# EAGLE design fabrickit-SnapBrick-Male-v22 (EAGLE 5.04)
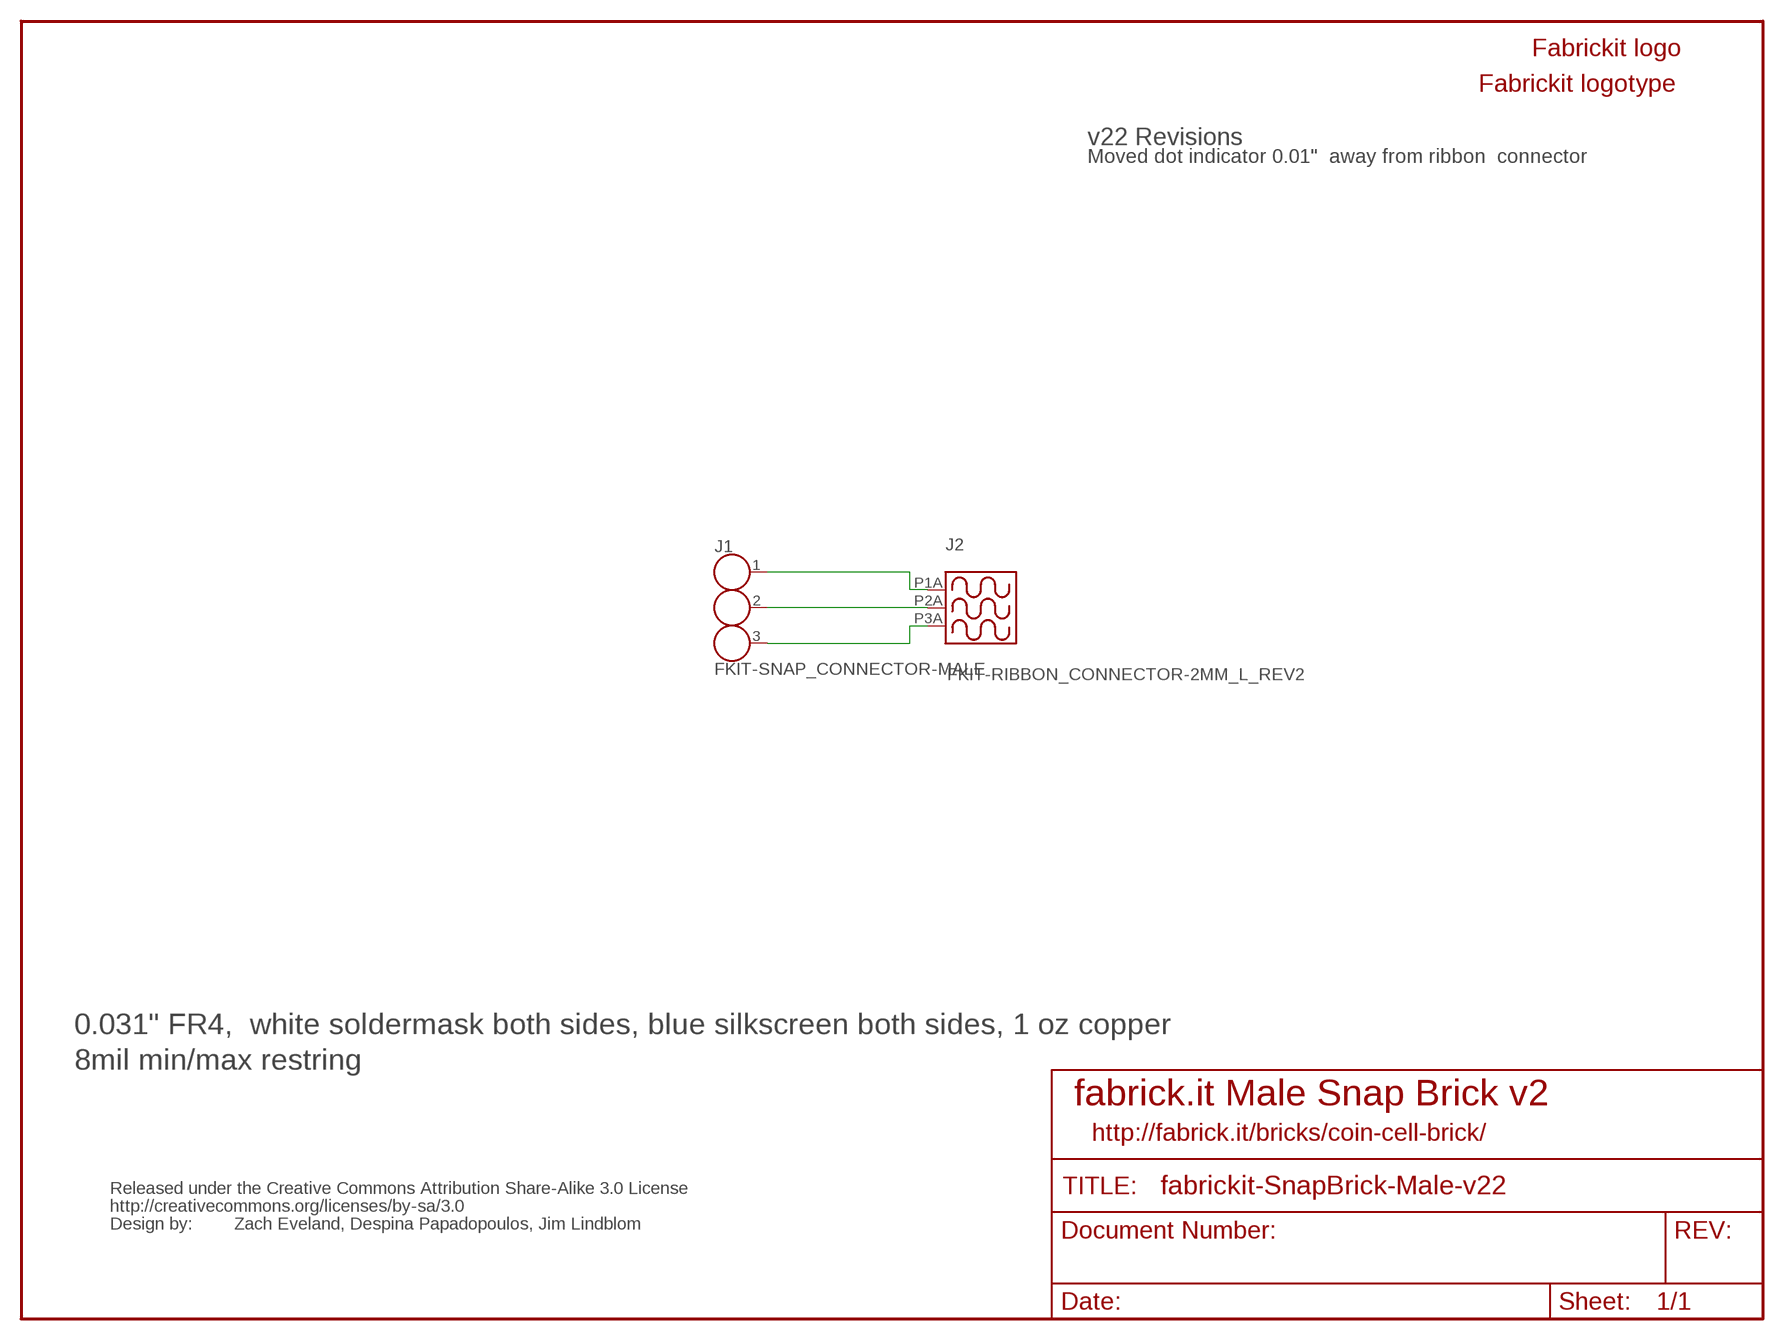
[diagram p0: schematic, sheet 1]

## Parts
J1  FKIT-SNAP_CONNECTOR-MALE  [FKIT-SNAP_MALE]
J2  FKIT-RIBBON_CONNECTOR-2MM_L_REV2  [FKIT-RIBBON_CONNECTOR_03_2MM_L]
LOGO1  FKIT-LOGO-SMALL  [FKIT-LOGO_SMALL]
LOGO2  FKIT-LOGOTYPE-MEDIUM  [FKIT-LOGOTYPE_MEDIUM]
U$1  CREATIVE_COMMONS  [CREATIVE_COMMONS]

## Nets
N$1: J1.3 J2.P3A
N$2: J1.2 J2.P2A
N$3: J1.1 J2.P1A

## Notes on the sheet
- v22 Revisions
- Moved dot indicator 0.01"  away from ribbon  connector
- 0.031" FR4,  white soldermask both sides, blue silkscreen both sides, 1 oz copper
- 8mil min/max restring
- fabrick.it Male Snap Brick v2
- http://fabrick.it/bricks/coin-cell-brick/
- Zach Eveland, Despina Papadopoulos, Jim Lindblom

## Library data of the parts
J1 = SparkFun:FKIT-SNAP_CONNECTOR
J2 = SparkFun:FKIT-RIBBON_CONNECTOR: fabrick.it Conductive Ribbon Connector
LOGO1 = SparkFun:FKIT-LOGO: Fabrick.it Logos
LOGO2 = SparkFun:FKIT-LOGOTYPE: Fabrick.it Logotype
U$1 = SparkFun:CREATIVE_COMMONS

## Net classes
0 Default: width 0.203 mm

## Board
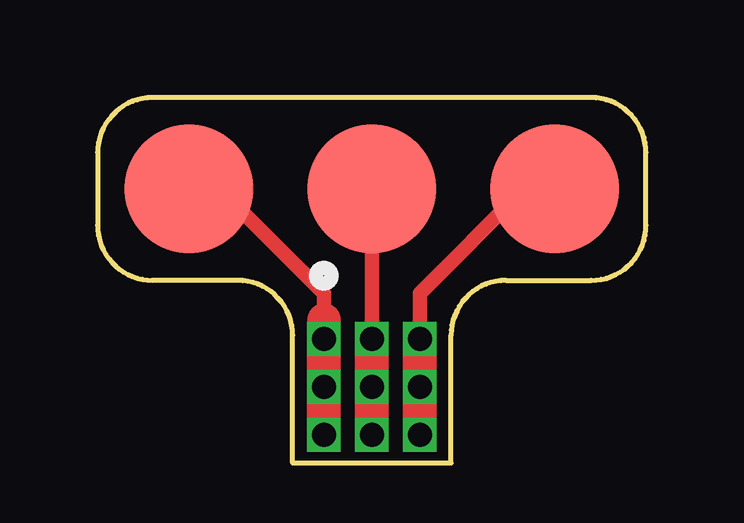
[diagram p1: board, top side]
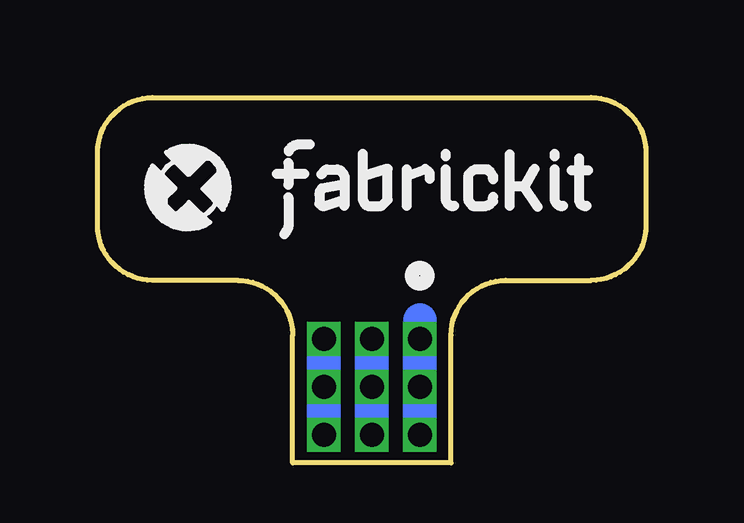
[diagram p2: board, bottom side, seen from below]

Size 22.86 x 15.24 mm. Coordinates in mm from the lower left corner, seen from the top.
Outline: 8.13,0 14.73,0 14.73,5.33 arc-90 17.02,7.62 20.57,7.62 arc90 22.86,9.91 22.86,12.95 arc90 20.57,15.24 2.29,15.24 arc90 0,12.95 0,9.91 arc90 2.29,7.62 5.84,7.62 arc-90 8.13,5.33 8.13,0
Copper layers (1*16): Top 0.035mm / dielectric 1.5mm / Bottom 0.035mm
Design rules "SparkFun *": minimum track width 8mil, minimum drill 20mil, track to track 8mil, track to pad 8mil, pad to pad 8mil, via to via 8mil, smd to smd 8mil, copper to edge 8mil, drill to drill 8mil, minimum pad ring 8mil, minimum via ring 10mil, stop-mask expansion 4mil, vias tented up to drill 20mil, thermal gap 10mil

### Footprints (pad centres in the part's own frame; a part is rotated, then mirrored left to right if it is on the bottom)
FKIT-SNAP_MALE = smd 5.385 x 5.385: 1 -7.62,0; 2 0,0; 3 7.62,0
FKIT-RIBBON_CONNECTOR_03_2MM_L = drill 1 pad 1.3 square: P1A -2,2; P1B -2,0; P1C -2,-2; P2A 0,2; P2B 0,0; P2C 0,-2; P3A 2,2; P3B 2,0; P3C 2,-2

### Placement (x,y rotation side)
J1  11.43,11.43 0 top
J2  11.43,3.17 0 top
LOGO1  19.05,11.43 0 bottom
LOGO2  8.89,11.43 0 bottom
U$1  0,-2.54 0 top

### Tracks (layer width: path | path; a pad name or v marks a point on that pad's centre or on a via)
N$1
  Top 0.61: J2.P3A 13.43,7.08 17.78,11.43 J1.3
N$2
  Top 0.61: J2.P2A J1.2
N$3
  Top 0.61: J2.P1A 9.43,7.08 5.08,11.43 J1.1